# EAGLE schematic Fatar Keyboard TP8S 61Keys (EAGLE 6.2)
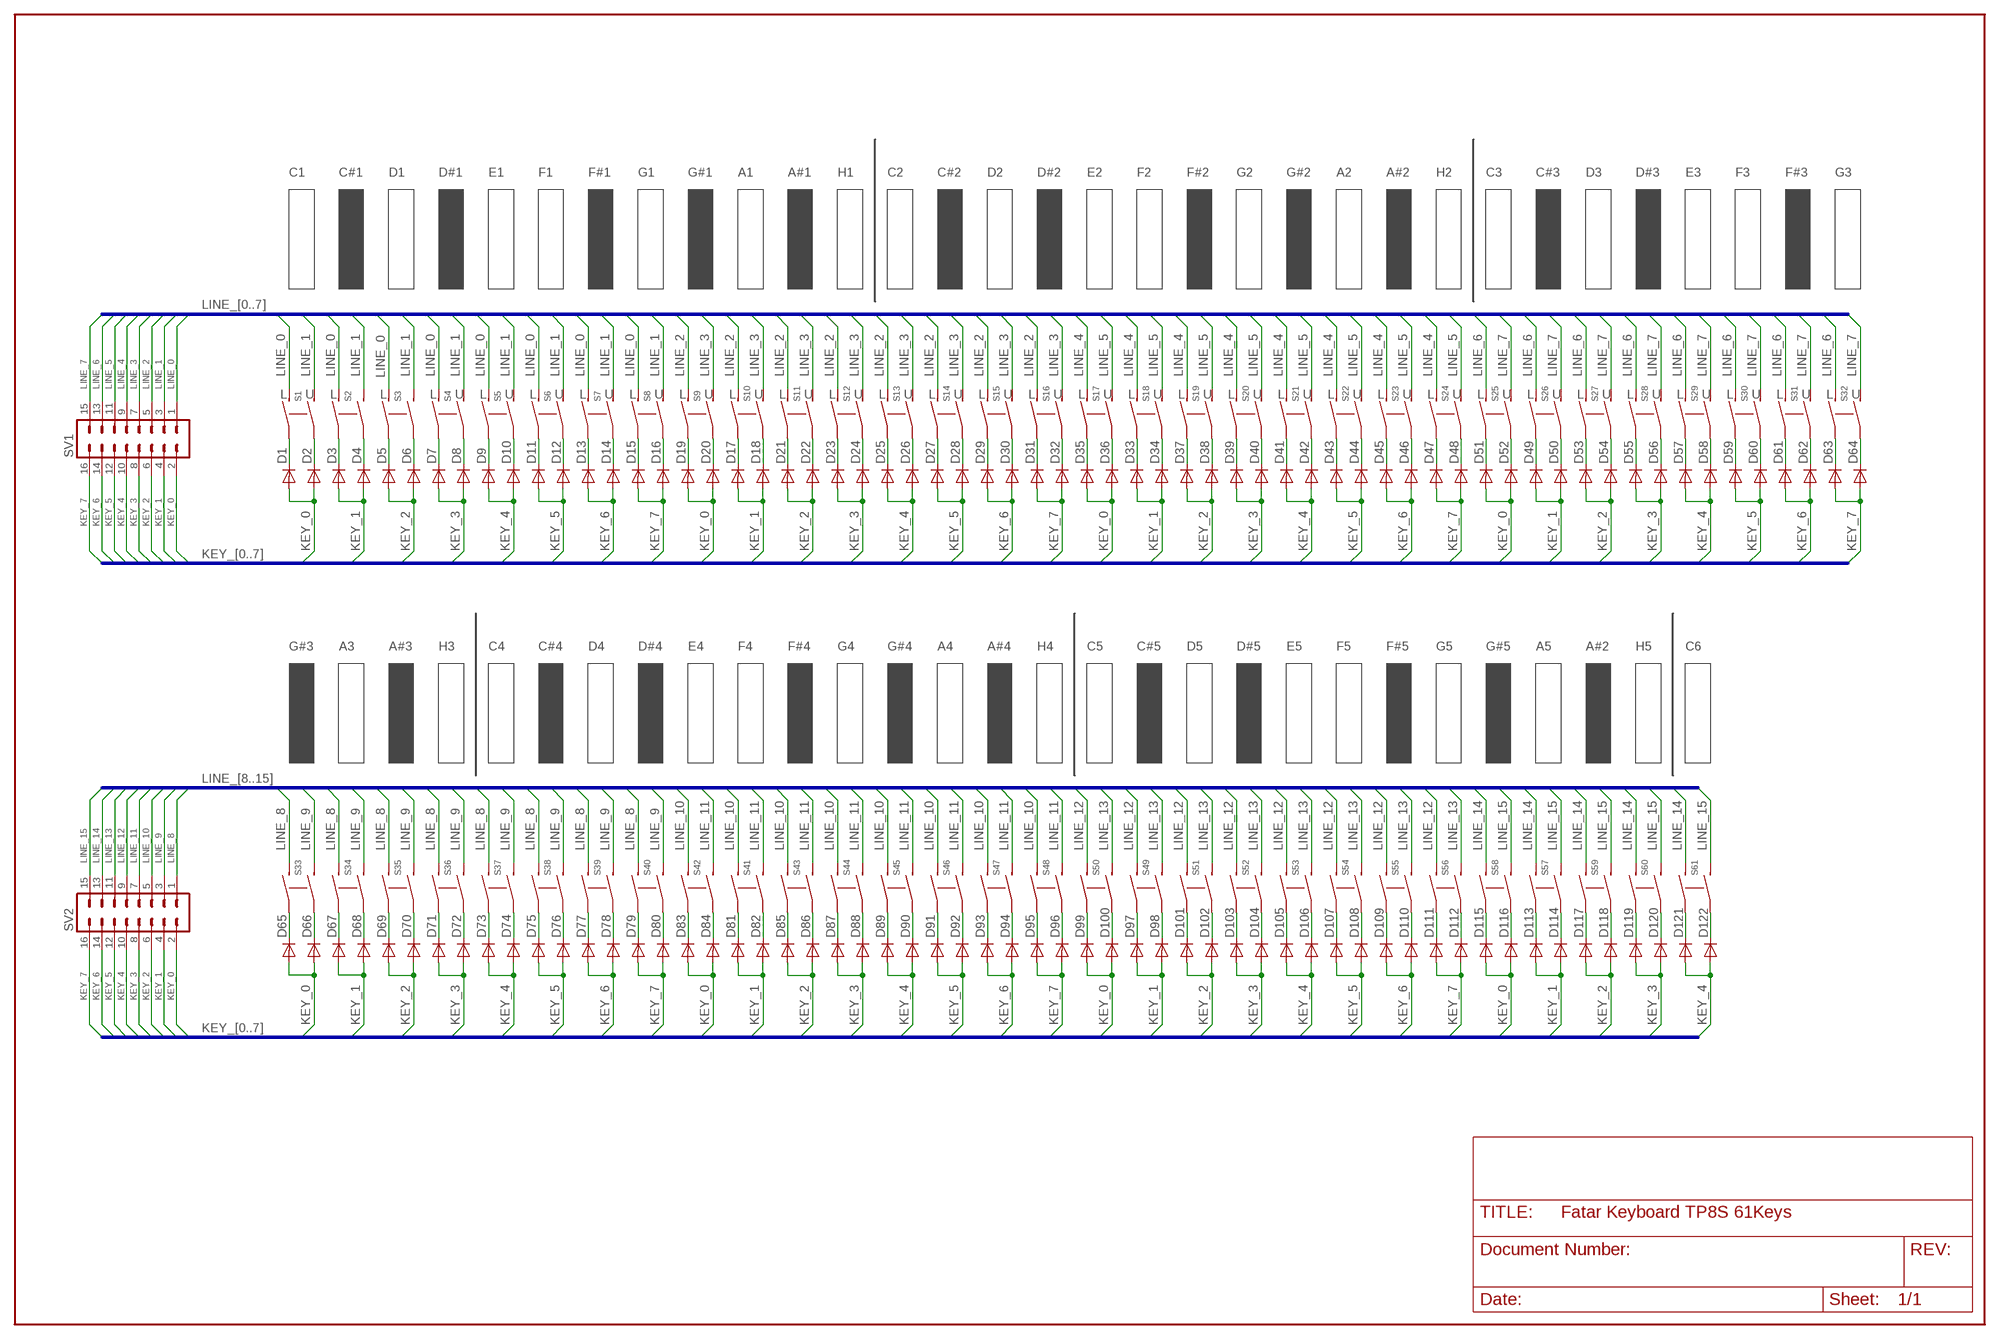
[diagram p0: schematic, sheet 1]

## Parts
D1  1N4148DO35-7  [DO35-7]
D2  1N4148DO35-7  [DO35-7]
D3  1N4148DO35-7  [DO35-7]
D4  1N4148DO35-7  [DO35-7]
D5  1N4148DO35-7  [DO35-7]
D6  1N4148DO35-7  [DO35-7]
D7  1N4148DO35-7  [DO35-7]
D8  1N4148DO35-7  [DO35-7]
D9  1N4148DO35-7  [DO35-7]
D10  1N4148DO35-7  [DO35-7]
D11  1N4148DO35-7  [DO35-7]
D12  1N4148DO35-7  [DO35-7]
D13  1N4148DO35-7  [DO35-7]
D14  1N4148DO35-7  [DO35-7]
D15  1N4148DO35-7  [DO35-7]
D16  1N4148DO35-7  [DO35-7]
D17  1N4148DO35-7  [DO35-7]
D18  1N4148DO35-7  [DO35-7]
D19  1N4148DO35-7  [DO35-7]
D20  1N4148DO35-7  [DO35-7]
D21  1N4148DO35-7  [DO35-7]
D22  1N4148DO35-7  [DO35-7]
D23  1N4148DO35-7  [DO35-7]
D24  1N4148DO35-7  [DO35-7]
D25  1N4148DO35-7  [DO35-7]
D26  1N4148DO35-7  [DO35-7]
D27  1N4148DO35-7  [DO35-7]
D28  1N4148DO35-7  [DO35-7]
D29  1N4148DO35-7  [DO35-7]
D30  1N4148DO35-7  [DO35-7]
D31  1N4148DO35-7  [DO35-7]
D32  1N4148DO35-7  [DO35-7]
D33  1N4148DO35-7  [DO35-7]
D34  1N4148DO35-7  [DO35-7]
D35  1N4148DO35-7  [DO35-7]
D36  1N4148DO35-7  [DO35-7]
D37  1N4148DO35-7  [DO35-7]
D38  1N4148DO35-7  [DO35-7]
D39  1N4148DO35-7  [DO35-7]
D40  1N4148DO35-7  [DO35-7]
D41  1N4148DO35-7  [DO35-7]
D42  1N4148DO35-7  [DO35-7]
D43  1N4148DO35-7  [DO35-7]
D44  1N4148DO35-7  [DO35-7]
D45  1N4148DO35-7  [DO35-7]
D46  1N4148DO35-7  [DO35-7]
D47  1N4148DO35-7  [DO35-7]
D48  1N4148DO35-7  [DO35-7]
D49  1N4148DO35-7  [DO35-7]
D50  1N4148DO35-7  [DO35-7]
D51  1N4148DO35-7  [DO35-7]
D52  1N4148DO35-7  [DO35-7]
D53  1N4148DO35-7  [DO35-7]
D54  1N4148DO35-7  [DO35-7]
D55  1N4148DO35-7  [DO35-7]
D56  1N4148DO35-7  [DO35-7]
D57  1N4148DO35-7  [DO35-7]
D58  1N4148DO35-7  [DO35-7]
D59  1N4148DO35-7  [DO35-7]
D60  1N4148DO35-7  [DO35-7]
D61  1N4148DO35-7  [DO35-7]
D62  1N4148DO35-7  [DO35-7]
D63  1N4148DO35-7  [DO35-7]
D64  1N4148DO35-7  [DO35-7]
D65  1N4148DO35-7  [DO35-7]
D66  1N4148DO35-7  [DO35-7]
D67  1N4148DO35-7  [DO35-7]
D68  1N4148DO35-7  [DO35-7]
D69  1N4148DO35-7  [DO35-7]
D70  1N4148DO35-7  [DO35-7]
D71  1N4148DO35-7  [DO35-7]
D72  1N4148DO35-7  [DO35-7]
D73  1N4148DO35-7  [DO35-7]
D74  1N4148DO35-7  [DO35-7]
D75  1N4148DO35-7  [DO35-7]
D76  1N4148DO35-7  [DO35-7]
D77  1N4148DO35-7  [DO35-7]
D78  1N4148DO35-7  [DO35-7]
D79  1N4148DO35-7  [DO35-7]
D80  1N4148DO35-7  [DO35-7]
D81  1N4148DO35-7  [DO35-7]
D82  1N4148DO35-7  [DO35-7]
D83  1N4148DO35-7  [DO35-7]
D84  1N4148DO35-7  [DO35-7]
D85  1N4148DO35-7  [DO35-7]
D86  1N4148DO35-7  [DO35-7]
D87  1N4148DO35-7  [DO35-7]
D88  1N4148DO35-7  [DO35-7]
D89  1N4148DO35-7  [DO35-7]
D90  1N4148DO35-7  [DO35-7]
D91  1N4148DO35-7  [DO35-7]
D92  1N4148DO35-7  [DO35-7]
D93  1N4148DO35-7  [DO35-7]
D94  1N4148DO35-7  [DO35-7]
D95  1N4148DO35-7  [DO35-7]
D96  1N4148DO35-7  [DO35-7]
D97  1N4148DO35-7  [DO35-7]
D98  1N4148DO35-7  [DO35-7]
D99  1N4148DO35-7  [DO35-7]
D100  1N4148DO35-7  [DO35-7]
D101  1N4148DO35-7  [DO35-7]
D102  1N4148DO35-7  [DO35-7]
D103  1N4148DO35-7  [DO35-7]
D104  1N4148DO35-7  [DO35-7]
D105  1N4148DO35-7  [DO35-7]
D106  1N4148DO35-7  [DO35-7]
D107  1N4148DO35-7  [DO35-7]
D108  1N4148DO35-7  [DO35-7]
D109  1N4148DO35-7  [DO35-7]
D110  1N4148DO35-7  [DO35-7]
D111  1N4148DO35-7  [DO35-7]
D112  1N4148DO35-7  [DO35-7]
D113  1N4148DO35-7  [DO35-7]
D114  1N4148DO35-7  [DO35-7]
D115  1N4148DO35-7  [DO35-7]
D116  1N4148DO35-7  [DO35-7]
D117  1N4148DO35-7  [DO35-7]
D118  1N4148DO35-7  [DO35-7]
D119  1N4148DO35-7  [DO35-7]
D120  1N4148DO35-7  [DO35-7]
D121  1N4148DO35-7  [DO35-7]
D122  1N4148DO35-7  [DO35-7]
S1  PVA1  [PVA1F]
S2  PVA1  [PVA1F]
S3  PVA1  [PVA1F]
S4  PVA1  [PVA1F]
S5  PVA1  [PVA1F]
S6  PVA1  [PVA1F]
S7  PVA1  [PVA1F]
S8  PVA1  [PVA1F]
S9  PVA1  [PVA1F]
S10  PVA1  [PVA1F]
S11  PVA1  [PVA1F]
S12  PVA1  [PVA1F]
S13  PVA1  [PVA1F]
S14  PVA1  [PVA1F]
S15  PVA1  [PVA1F]
S16  PVA1  [PVA1F]
S17  PVA1  [PVA1F]
S18  PVA1  [PVA1F]
S19  PVA1  [PVA1F]
S20  PVA1  [PVA1F]
S21  PVA1  [PVA1F]
S22  PVA1  [PVA1F]
S23  PVA1  [PVA1F]
S24  PVA1  [PVA1F]
S25  PVA1  [PVA1F]
S26  PVA1  [PVA1F]
S27  PVA1  [PVA1F]
S28  PVA1  [PVA1F]
S29  PVA1  [PVA1F]
S30  PVA1  [PVA1F]
S31  PVA1  [PVA1F]
S32  PVA1  [PVA1F]
S33  PVA1  [PVA1F]
S34  PVA1  [PVA1F]
S35  PVA1  [PVA1F]
S36  PVA1  [PVA1F]
S37  PVA1  [PVA1F]
S38  PVA1  [PVA1F]
S39  PVA1  [PVA1F]
S40  PVA1  [PVA1F]
S41  PVA1  [PVA1F]
S42  PVA1  [PVA1F]
S43  PVA1  [PVA1F]
S44  PVA1  [PVA1F]
S45  PVA1  [PVA1F]
S46  PVA1  [PVA1F]
S47  PVA1  [PVA1F]
S48  PVA1  [PVA1F]
S49  PVA1  [PVA1F]
S50  PVA1  [PVA1F]
S51  PVA1  [PVA1F]
S52  PVA1  [PVA1F]
S53  PVA1  [PVA1F]
S54  PVA1  [PVA1F]
S55  PVA1  [PVA1F]
S56  PVA1  [PVA1F]
S57  PVA1  [PVA1F]
S58  PVA1  [PVA1F]
S59  PVA1  [PVA1F]
S60  PVA1  [PVA1F]
S61  PVA1  [PVA1F]
SV1  ML16  [ML16]
SV2  ML16  [ML16]

## Nets
KEY_0: D1.A D2.A D19.A D20.A D35.A D36.A D51.A D52.A D65.A D66.A D83.A D84.A D99.A D100.A D115.A D116.A SV1.2 SV2.2
KEY_1: D3.A D4.A D17.A D18.A D33.A D34.A D49.A D50.A D67.A D68.A D81.A D82.A D97.A D98.A D113.A D114.A SV1.4 SV2.4
KEY_2: D5.A D6.A D21.A D22.A D37.A D38.A D53.A D54.A D69.A D70.A D85.A D86.A D101.A D102.A D117.A D118.A SV1.6 SV2.6
KEY_3: D7.A D8.A D23.A D24.A D39.A D40.A D55.A D56.A D71.A D72.A D87.A D88.A D103.A D104.A D119.A D120.A SV1.8 SV2.8
KEY_4: D9.A D10.A D25.A D26.A D41.A D42.A D57.A D58.A D73.A D74.A D89.A D90.A D105.A D106.A D121.A D122.A SV1.10 SV2.10
KEY_5: D11.A D12.A D27.A D28.A D43.A D44.A D59.A D60.A D75.A D76.A D91.A D92.A D107.A D108.A SV1.12 SV2.12
KEY_6: D13.A D14.A D29.A D30.A D45.A D46.A D61.A D62.A D77.A D78.A D93.A D94.A D109.A D110.A SV1.14 SV2.14
KEY_7: D15.A D16.A D31.A D32.A D47.A D48.A D63.A D64.A D79.A D80.A D95.A D96.A D111.A D112.A SV1.16 SV2.16
LINE_0: S1.4(S1) S2.4(S1) S3.4(S1) S4.4(S1) S5.4(S1) S6.4(S1) S7.4(S1) S8.4(S1) SV1.1
LINE_1: S1.3(S) S2.3(S) S3.3(S) S4.3(S) S5.3(S) S6.3(S) S7.3(S) S8.3(S) SV1.3
LINE_2: S9.4(S1) S10.4(S1) S11.4(S1) S12.4(S1) S13.4(S1) S14.4(S1) S15.4(S1) S16.4(S1) SV1.5
LINE_3: S9.3(S) S10.3(S) S11.3(S) S12.3(S) S13.3(S) S14.3(S) S15.3(S) S16.3(S) SV1.7
LINE_4: S17.4(S1) S18.4(S1) S19.4(S1) S20.4(S1) S21.4(S1) S22.4(S1) S23.4(S1) S24.4(S1) SV1.9
LINE_5: S17.3(S) S18.3(S) S19.3(S) S20.3(S) S21.3(S) S22.3(S) S23.3(S) S24.3(S) SV1.11
LINE_6: S25.4(S1) S26.4(S1) S27.4(S1) S28.4(S1) S29.4(S1) S30.4(S1) S31.4(S1) S32.4(S1) SV1.13
LINE_7: S25.3(S) S26.3(S) S27.3(S) S28.3(S) S29.3(S) S30.3(S) S31.3(S) S32.3(S) SV1.15
LINE_8: S33.4(S1) S34.4(S1) S35.4(S1) S36.4(S1) S37.4(S1) S38.4(S1) S39.4(S1) S40.4(S1) SV2.1
LINE_9: S33.3(S) S34.3(S) S35.3(S) S36.3(S) S37.3(S) S38.3(S) S39.3(S) S40.3(S) SV2.3
LINE_10: S41.4(S1) S42.4(S1) S43.4(S1) S44.4(S1) S45.4(S1) S46.4(S1) S47.4(S1) S48.4(S1) SV2.5
LINE_11: S41.3(S) S42.3(S) S43.3(S) S44.3(S) S45.3(S) S46.3(S) S47.3(S) S48.3(S) SV2.7
LINE_12: S49.4(S1) S50.4(S1) S51.4(S1) S52.4(S1) S53.4(S1) S54.4(S1) S55.4(S1) S56.4(S1) SV2.9
LINE_13: S49.3(S) S50.3(S) S51.3(S) S52.3(S) S53.3(S) S54.3(S) S55.3(S) S56.3(S) SV2.11
LINE_14: S57.4(S1) S58.4(S1) S59.4(S1) S60.4(S1) S61.4(S1) SV2.13
LINE_15: S57.3(S) S58.3(S) S59.3(S) S60.3(S) S61.3(S) SV2.15
N$1: D1.C S1.2(P1)
N$2: D2.C S1.1(P)
N$3: D65.C S33.2(P1)
N$4: D66.C S33.1(P)
N$5: D67.C S34.2(P1)
N$6: D3.C S2.2(P1)
N$7: D4.C S2.1(P)
N$8: D68.C S34.1(P)
N$9: D7.C S4.2(P1)
N$10: D8.C S4.1(P)
N$11: D5.C S3.2(P1)
N$12: D6.C S3.1(P)
N$13: D69.C S35.2(P1)
N$14: D70.C S35.1(P)
N$15: D17.C S10.2(P1)
N$16: D18.C S10.1(P)
N$17: D9.C S5.2(P1)
N$18: D10.C S5.1(P)
N$19: D71.C S36.2(P1)
N$20: D72.C S36.1(P)
N$21: D19.C S9.2(P1)
N$22: D11.C S6.2(P1)
N$23: D12.C S6.1(P)
N$24: D73.C S37.2(P1)
N$25: D20.C S9.1(P)
N$26: D74.C S37.1(P)
N$27: D13.C S7.2(P1)
N$28: D14.C S7.1(P)
N$29: D75.C S38.2(P1)
N$30: D76.C S38.1(P)
N$31: D77.C S39.2(P1)
N$32: D15.C S8.2(P1)
N$33: D16.C S8.1(P)
N$34: D78.C S39.1(P)
N$35: D21.C S11.2(P1)
N$36: D22.C S11.1(P)
N$37: D79.C S40.2(P1)
N$38: D23.C S12.2(P1)
N$39: D24.C S12.1(P)
N$40: D80.C S40.1(P)
N$41: D25.C S13.2(P1)
N$42: D26.C S13.1(P)
N$43: D81.C S41.2(P1)
N$44: D27.C S14.2(P1)
N$45: D28.C S14.1(P)
N$46: D82.C S41.1(P)
N$47: D29.C S15.2(P1)
N$48: D30.C S15.1(P)
N$49: D83.C S42.2(P1)
N$50: D31.C S16.2(P1)
N$51: D32.C S16.1(P)
N$52: D84.C S42.1(P)
N$53: D33.C S18.2(P1)
N$54: D34.C S18.1(P)
N$55: D85.C S43.2(P1)
N$56: D35.C S17.2(P1)
N$57: D36.C S17.1(P)
N$58: D86.C S43.1(P)
N$59: D87.C S44.2(P1)
N$60: D88.C S44.1(P)
N$61: D37.C S19.2(P1)
N$62: D38.C S19.1(P)
N$63: D89.C S45.2(P1)
N$64: D39.C S20.2(P1)
N$65: D40.C S20.1(P)
N$66: D90.C S45.1(P)
N$67: D41.C S21.2(P1)
N$68: D42.C S21.1(P)
N$69: D91.C S46.2(P1)
N$70: D43.C S22.2(P1)
N$71: D44.C S22.1(P)
N$72: D92.C S46.1(P)
N$73: D45.C S23.2(P1)
N$74: D46.C S23.1(P)
N$75: D93.C S47.2(P1)
N$76: D47.C S24.2(P1)
N$77: D48.C S24.1(P)
N$78: D94.C S47.1(P)
N$79: D49.C S26.2(P1)
N$80: D50.C S26.1(P)
N$81: D95.C S48.2(P1)
N$82: D51.C S25.2(P1)
N$83: D52.C S25.1(P)
N$84: D96.C S48.1(P)
N$85: D97.C S49.2(P1)
N$86: D98.C S49.1(P)
N$87: D53.C S27.2(P1)
N$88: D54.C S27.1(P)
N$89: D99.C S50.2(P1)
N$90: D55.C S28.2(P1)
N$91: D56.C S28.1(P)
N$92: D100.C S50.1(P)
N$93: D57.C S29.2(P1)
N$94: D58.C S29.1(P)
N$95: D101.C S51.2(P1)
N$96: D59.C S30.2(P1)
N$97: D60.C S30.1(P)
N$98: D102.C S51.1(P)
N$99: D61.C S31.2(P1)
N$100: D62.C S31.1(P)
N$101: D103.C S52.2(P1)
N$102: D63.C S32.2(P1)
N$103: D64.C S32.1(P)
N$104: D104.C S52.1(P)
N$105: D105.C S53.2(P1)
N$106: D106.C S53.1(P)
N$107: D107.C S54.2(P1)
N$108: D108.C S54.1(P)
N$109: D109.C S55.2(P1)
N$110: D110.C S55.1(P)
N$111: D111.C S56.2(P1)
N$112: D112.C S56.1(P)
N$113: D113.C S57.2(P1)
N$114: D114.C S57.1(P)
N$115: D115.C S58.2(P1)
N$116: D116.C S58.1(P)
N$117: D117.C S59.2(P1)
N$118: D118.C S59.1(P)
N$119: D119.C S60.2(P1)
N$120: D120.C S60.1(P)
N$121: D121.C S61.2(P1)
N$122: D122.C S61.1(P)

## Buses
KEY_[0..7]
LINE_[0..7]
LINE_[8..15]

## Notes on the sheet
- C1 | C#1 | D1 | D#1 | E1 | F1 | F#1 | G1 | G#1 | A1 | A#1 | H1 | C2 | C#2 | D2 | D#2 | E2 | F2 | F#2 | G2 | G#2 | A2 | A#2 | H2 | C3 | C#3 | D3 | D#3 | E3 | F3 | F#3 | G3
- L | U | L | L | L | U | L | U | L | U | L | U | L | U | L | U | L | U | L | U | L | U | L | U | L | U | L | U | L | U | L | U | L | U | L | U | L | U | L | U | L | U | L | U | L | U | L | U | L | U | L | U | L | U | L | U | L | U | L | U | L | U
- G#3 | A3 | A#3 | H3 | C4 | C#4 | D4 | D#4 | E4 | F4 | F#4 | G4 | G#4 | A4 | A#4 | H4 | C5 | C#5 | D5 | D#5 | E5 | F5 | F#5 | G5 | G#5 | A5 | A#2 | H5 | C6

## Library data of the parts
D1-D122 = diode:1N4148: DIODE high speed (Philips)
S1-S61 = switch-misc:PVA1: ITT SWITCH
SV1 SV2 = con-harting-ml:ML16: HARTING; OC_FARNELL: unknown; OC_NEWARK: unknown